# Altium schematic sheet Sheet2.SchDoc
size A4
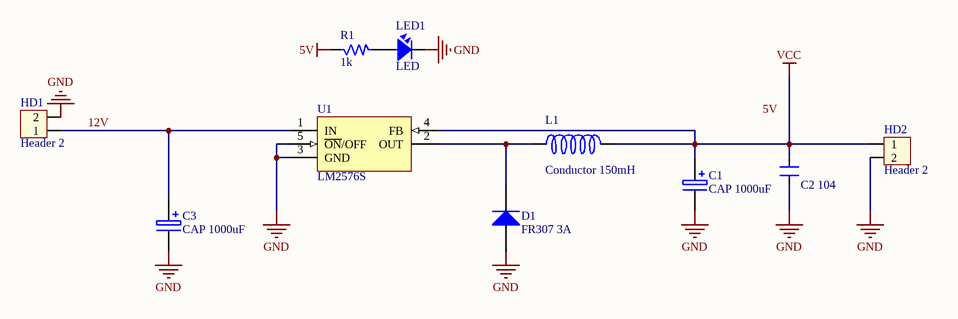
[diagram p0: Sheet2.SchDoc]

## Parts
C1  CAP 1000uF  [CP2/4]
C2_104  CAP gom  [CN3]  (value not drawn)
C3  CAP 1000uF  [CP2/4]
D1  FR307 3A  [DIODE/POW/3A]
HD1  Header 2  [HED2]
HD2  Header 2  [HED2]
L1  Conductor 150mH  [CUON CAM 200mil]
LED1  LED  [LED-3]
R1  1k  [R1/4W]
U1  LM2576S  [LM2576t]

## Nets
5V: R1.1
GND: C1.2 C2_104.1 C3.2 D1.1(A) HD1.2 HD2.2 LED1.2 U1.3(GND) U1.5(~{ON}/OFF)
VCC: C1.1 C2_104.2 HD2.1 L1.2 U1.4(FB)
12V: C3.1 HD1.1 U1.1(IN)
NetD1_2: D1.2(K) L1.1 U1.2(OUT)
NetLED1_1: LED1.1 R1.2

## Notes on the sheet
- Labels drawn without touching a wire or pin: 5V

## Library data of the parts
C1 C3 = CAP hoa: Cap
D1 = Diode Power 3A: Diode Power; Published: 8-Jun-2000; LatestRevisionDate: 17-Jul-2002; LatestRevisionNote: Re-released for DXP Platform.; DatasheetDocument: 1998; PackageDocument: Aug-1999; PackageReference: DO-201AD; Publisher: Altium Limited; ComponentLink1Description: Manufacturer Link; ComponentLink1URL: http://www.fairchildsemi.com/; ComponentLink2Description: Datasheet; ComponentLink2URL: http://www.fairchildsemi.com/ds/1N%2F1N5400.pdf
HD1 HD2 = Header 2: Header 2 (Green); Value: Header 2
L1 = Conductor
LED1 = LED: LED Single colour Green and Red; Value: LED 3 ly Single Colour
R1 = R: Resistor 1/4W; Value: R1/4W - 1K
U1 = LM2576S: Simple Switcher 3A Step Down Voltage Regulator; Note: Tab is connected to GND; Published: 15-Apr-2002; DatasheetVersion: Jun-1999; PackageReference: TS5B; Publisher: Altium Limited; PackageDescription: D2-PAK; 5 Leads; Body 14.4 (inc. leads) x 10.4 mm (LxW max); ComponentLink1Description: Manufacturer Link; ComponentLink1URL: http://www.national.com/; ComponentLink2Description: Datasheet; ComponentLink2URL: http://www.national.com/ds.cgi/LM/LM2576.pdf; ComponentLink3Description: URL Link1; ComponentLink3URL: http://www.national.com/pf/LM/LM2576.html